# Altium project QUADCOPTER.PrjPcb
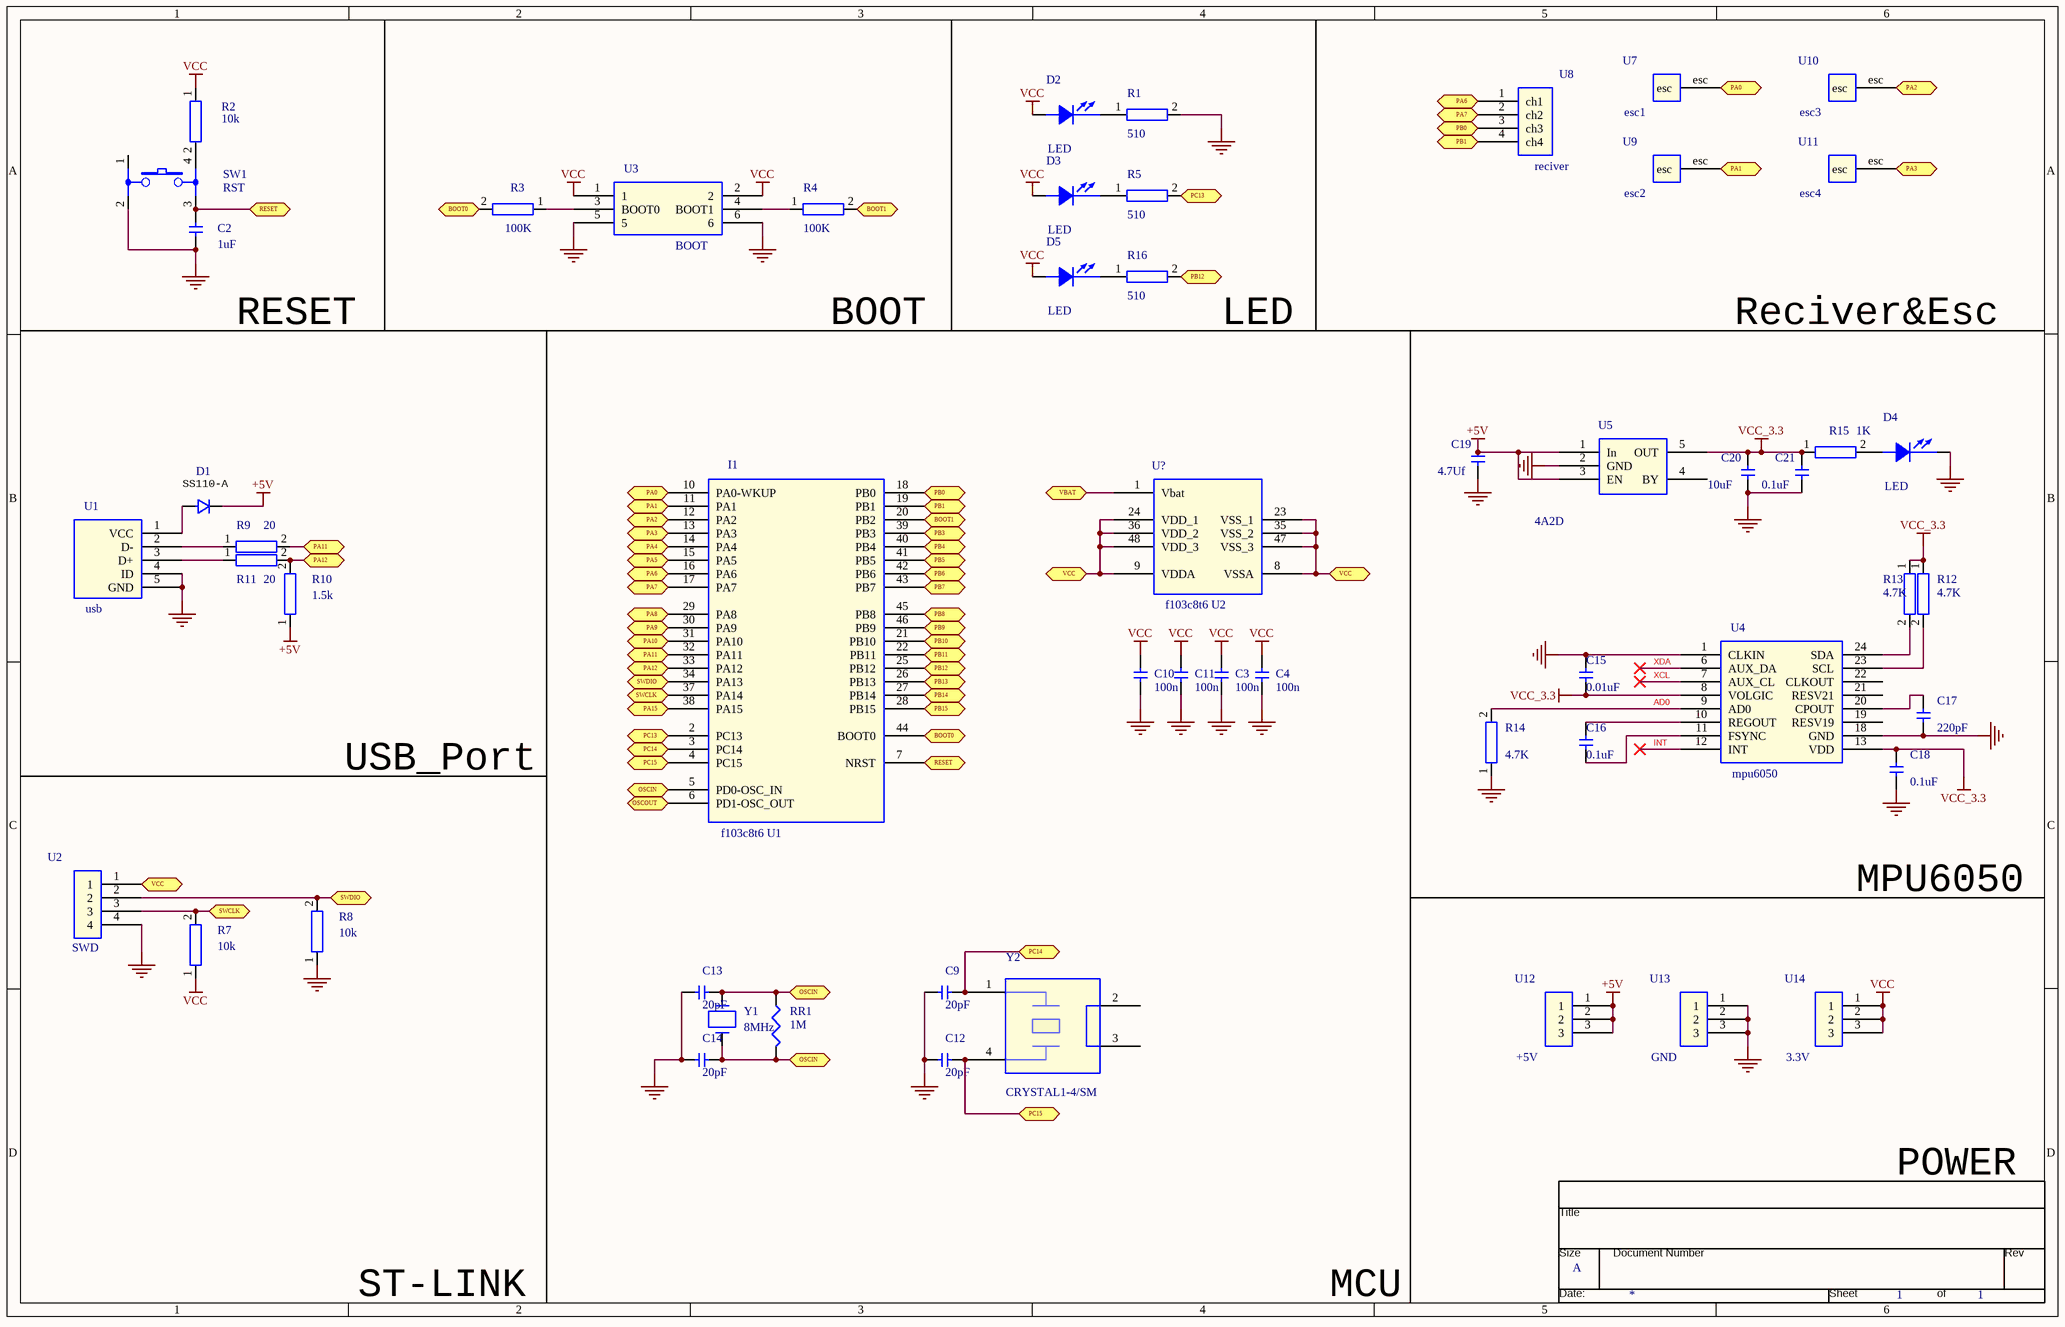
[diagram p0: Quadcopter.SchDoc]
1 sheet, 56 parts. Net scope: flat (ports and power ports of the same name join across sheets).

## Sheet Quadcopter.SchDoc
size 386 x 246 mm

### Parts
*  Page Size: A  Page Number: 1  (hidden comment: TitleBlock0)  (graphical)
C2  1uF  [RAD/CK05]
C3  100n  [RAD/CK05]
C4  100n  [RAD/CK05]
C9  20pF  [RAD/CK05]
C10  100n  [RAD/CK05]
C11  100n  [RAD/CK05]
C12  20pF  [RAD/CK05]
C13  20pF  [RAD/CK05]
C14  20pF  [RAD/CK05]
C15  0.01uF  [RAD/CK05]
C16  0.1uF  [RAD/CK05]
C17  220pF  [RAD/CK05]
C18  0.1uF  [RAD/CK05]
C19  4.7Uf  [RAD/CK05]
C20  10uF  [RAD/CK05]
C21  0.1uF  [RAD/CK05]
D1  d  (value not drawn)
D2  LED
D3  LED
D4  LED
D5  LED
I1  f103c8t6 U1
R1  510
R2  10k
R3  100K
R4  100K
R5  510
R7  10k
R8  10k
R9  20
R10  1.5k
R11  20
R12  4.7K
R13  4.7K
R14  4.7K
R15  1K
R16  510
RR1  1M
SW1  RST
U1  usb
U2  SWD
U3  BOOT  [BOOT]
U4  mpu6050
U5  4A2D
U7  esc1
U8  reciver
U9  esc2
U10  esc3
U11  esc4
U12  +5V
U13  GND
U14  3.3V
U?  f103c8t6 U2  [stm32f103c8t6]
Y1  8MHz
Y2  CRYSTAL1-4/SM

### Ports
BOOT0 (bidir), BOOT1 (bidir), OSCIN (bidir), OSCOUT (bidir), PA0 (bidir), PA1 (bidir), PA2 (bidir), PA3 (bidir), PA4 (bidir), PA5 (bidir), PA6 (bidir), PA7 (bidir), PA8 (bidir), PA9 (bidir), PA10 (bidir), PA11 (bidir), PA12 (bidir), PA15 (bidir), PB0 (bidir), PB1 (bidir), PB3 (bidir), PB4 (bidir), PB5 (bidir), PB6 (bidir), PB7 (bidir), PB8 (bidir), PB9 (bidir), PB10 (bidir), PB11 (bidir), PB12 (bidir), PB13 (bidir), PB14 (bidir), PB15 (bidir), PC13 (bidir), PC14 (bidir), PC15 (bidir), RESET (bidir), SWCLK (bidir), SWDIO (bidir), VBAT (bidir), VCC (bidir)

### Nets
+5V: C19.2 D1.1 R10.1 U5.1(In) U5.3(EN) U12.1 U12.2 U12.3
GND: C2.1 C15.2 C17.1 C18.1 C19.1 C20.1 C21.1 D4.1(CATHODE) R1.2 R14.1 SW1.2 U3.5 U3.6 U4.1(CLKIN) U4.18(GND) U5.2(GND) U13.1 U13.2 U13.3
GND_POWER: C3.1 C4.1 C9.1 C10.1 C11.1 C12.1 C13.1 C14.1 R8.1 U1.4(ID) U1.5(GND) U2.4
VCC: C3.2 C4.2 C10.2 C11.2 D2.2(ANODE) D3.2(ANODE) D5.2(ANODE) R2.1 R7.1 U3.1 U3.2 U14.1 U14.2 U14.3
VCC_3.3: C15.1 C18.2 C20.2 C21.2 R12.1 R13.1 R15.1 U4.8(VOLGIC) U4.13(VDD) U5.5(OUT)
AD0: R14.2 U4.9(AD0)
INT: U4.12(INT)
XCL: U4.7(AUX_CL)
XDA: U4.6(AUX_DA)
NetC2_2: C2.2 I1.7(NRST) SW1.3 ; port RESET
NetC9_2: C9.2 I1.3(PC14) Y2.1 ; port PC14
NetC12_2: C12.2 I1.4(PC15) Y2.4 ; port PC15
NetC13_2: C13.2 C14.2 I1.5(PD0-OSC_IN) RR1.1 RR1.2 Y1.1 Y1.2 ; port OSCIN
NetC16_1: C16.1 U4.11(FSYNC)
NetC16_2: C16.2 U4.10(REGOUT)
NetC17_2: C17.2 U4.20(CPOUT)
NetD1_0: D1.0 U1.1(VCC)
NetD2_1: D2.1(CATHODE) R1.1
NetD3_1: D3.1(CATHODE) R5.1
NetD4_2: D4.2(ANODE) R15.2
NetD5_1: D5.1(CATHODE) R16.1
NetI1_2: I1.2(PC13) R5.2 ; port PC13
NetI1_6: I1.6(PD1-OSC_OUT) ; port OSCOUT
NetI1_10: I1.10(PA0-WKUP) U7.esc ; port PA0
NetI1_11: I1.11(PA1) U9.esc ; port PA1
NetI1_12: I1.12(PA2) U10.esc ; port PA2
NetI1_13: I1.13(PA3) U11.esc ; port PA3
NetI1_14: I1.14(PA4) ; port PA4
NetI1_15: I1.15(PA5) ; port PA5
NetI1_16: I1.16(PA6) U8.1(ch1) ; port PA6
NetI1_17: I1.17(PA7) U8.2(ch2) ; port PA7
NetI1_18: I1.18(PB0) U8.3(ch3) ; port PB0
NetI1_19: I1.19(PB1) U8.4(ch4) ; port PB1
NetI1_20: I1.20(PB2) R4.2 ; port BOOT1
NetI1_21: I1.21(PB10) ; port PB10
NetI1_22: I1.22(PB11) ; port PB11
NetI1_25: I1.25(PB12) R16.2 ; port PB12
NetI1_26: I1.26(PB13) ; port PB13
NetI1_27: I1.27(PB14) ; port PB14
NetI1_28: I1.28(PB15) ; port PB15
NetI1_29: I1.29(PA8) ; port PA8
NetI1_30: I1.30(PA9) ; port PA9
NetI1_31: I1.31(PA10) ; port PA10
NetI1_32: I1.32(PA11) R9.2 ; port PA11
NetI1_33: I1.33(PA12) R10.2 R11.2 ; port PA12
NetI1_34: I1.34(PA13) R8.2 U2.2 ; port SWDIO
NetI1_37: I1.37(PA14) R7.2 U2.3 ; port SWCLK
NetI1_38: I1.38(PA15) ; port PA15
NetI1_39: I1.39(PB3) ; port PB3
NetI1_40: I1.40(PB4) ; port PB4
NetI1_41: I1.41(PB5) ; port PB5
NetI1_42: I1.42(PB6) ; port PB6
NetI1_43: I1.43(PB7) ; port PB7
NetI1_44: I1.44(BOOT0) R3.2 ; port BOOT0
NetI1_45: I1.45(PB8) ; port PB8
NetI1_46: I1.46(PB9) ; port PB9
NetR2_2: R2.2 SW1.4
NetR3_1: R3.1 U3.3(BOOT0)
NetR4_1: R4.1 U3.4(BOOT1)
NetR9_1: R9.1 U1.2(D-)
NetR11_1: R11.1 U1.3(D+)
NetR12_2: R12.2 U4.23(SCL)
NetR13_2: R13.2 U4.24(SDA)
NetU2_1: U2.1 U?.8(VSSA) U?.9(VDDA) U?.23(VSS_1) U?.24(VDD_1) U?.35(VSS_2) U?.36(VDD_2) U?.47(VSS_3) U?.48(VDD_3) ; port VCC
NetU?_1: U?.1(Vbat) ; port VBAT

Not connected (* = marked no-connect by the designer): SW1 1; U4 19(RESV19) 21(RESV21) 22(CLKOUT); U5 4(BY); Y2 2 3

### Notes on the sheet
- RESET
- BOOT
- LED
- Reciver&Esc
- (near D1) SS110-A
- USB_Port
- MPU6050
- POWER
- ST-LINK
- MCU
- (in symbol TitleBlock0) Title; Size; Document Number; Rev; Date:; Sheet; of

### Library data of the parts
C2-C4 C9-C21 = C: VC2: 0; MAX_TEMP: CTMAX; SLOPE: CSMAX; KNEE: CBMAX; CURRENT: CIMAX; VOLTAGE: CMAX; PSpiceTemplate: C^@REFDES %1 %2 ?TOLERANCE|C^@REFDES| @VALUE ?IC/IC=@IC/ TC=@TC1,@TC2 ?TOLERANCE|\n.model C^@REFDES CAP C=1 DEV=@TOLERANCE% TC1=@TC1 TC2=@TC2 VC1=@VC1 VC2=@VC2|; DIST: FLAT; VC1: 0; TC1: 0; TC2: 0; PCB Footprint: RAD/CK05
  C2: Value: 1uF
  C3 C4 C10 C11: Value: 100n
  C9 C12-C14: Value: 20pF
  C15: Value: 0.01uF
  C16 C18 C21: Value: 0.1uF
  C17: Value: 220pF
  C19: Value: 4.7Uf
  C20: Value: 10uF
D1 = d: PSpiceTemplate: D^@REFDES %1 %2 @MODEL ~AREA|?AREA/@AREA/||@AREA|
R1-R5 R7-R16 = R
RR1 = R_Dup1
SW1 = SW PUSHBUTTON-SPST-2/SM
U2 = ST-LINK
U7 U9-U11 = esc
Y1 = CRYSTAL
* = TitleBlock0: Page Create Date: March  8, 1995; Page Count: 1; Page Modify Date: *
U3 = BOOT: PCB Footprint: BOOT
U? = f103c8t6 U2: PCB Footprint: stm32f103c8t6